# Altium schematic sheet Main.SchDoc
size A3; SheetNumber: 1; SheetTotal: 1
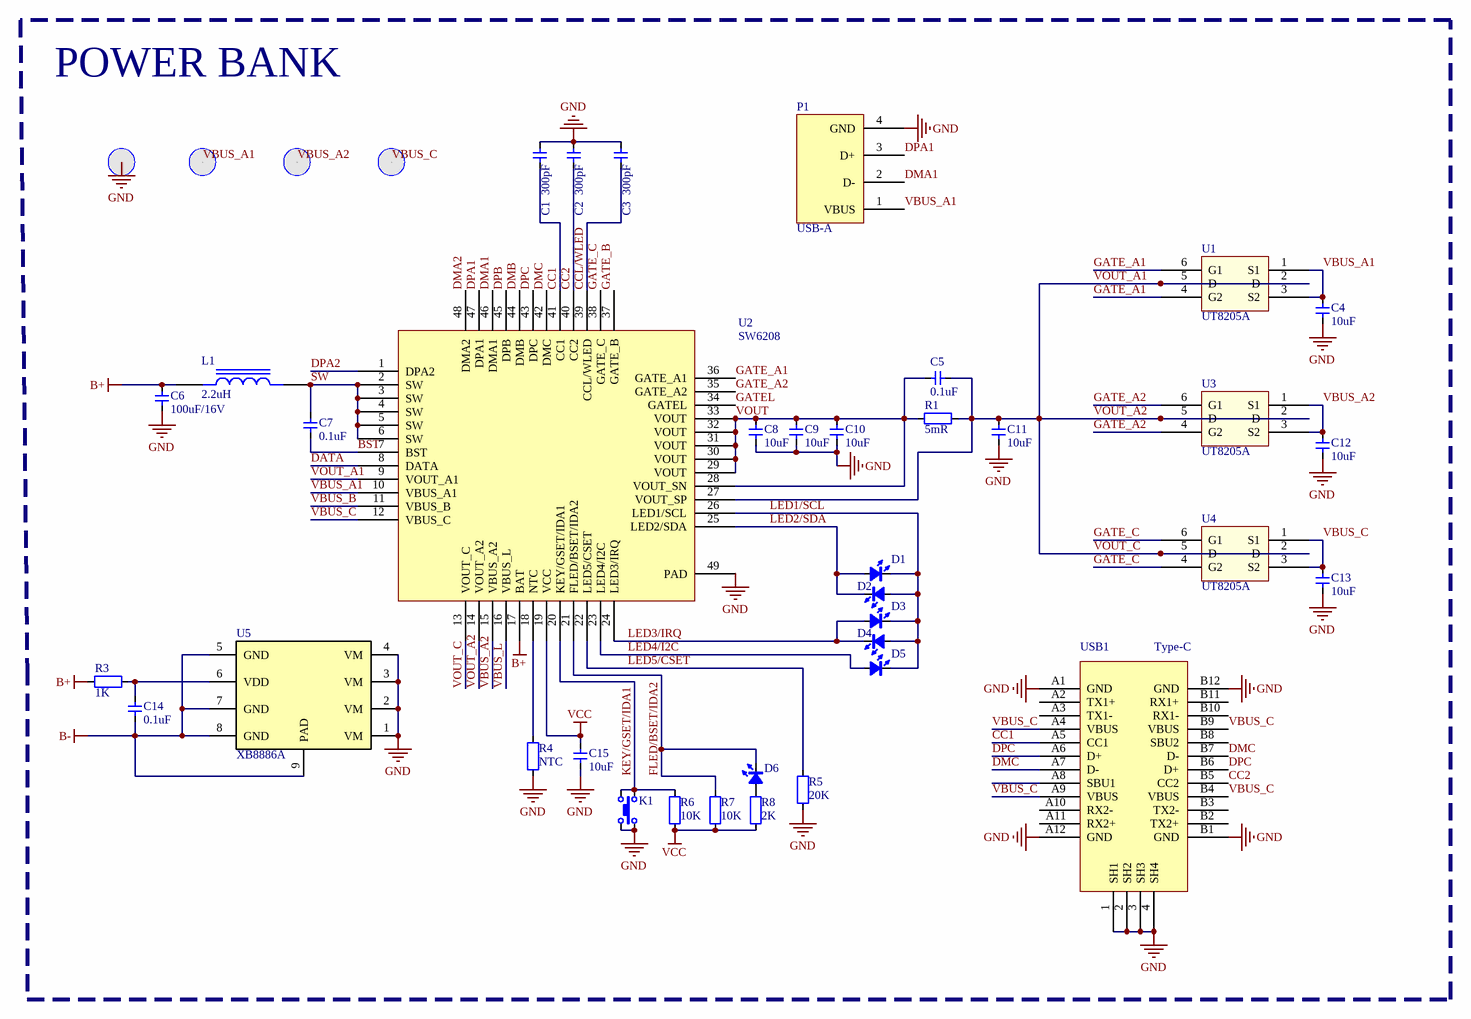
[diagram p0: Main.SchDoc]

## Parts
C1  300pF  [CAP_0402]
C2  300pF  [CAP_0402]
C3  300pF  [CAP_0402]
C4  10uF  [0603-CAP]
C5  0.1uF  [CAP_0402]
C6  100uF/16V  [1206-CAP]
C7  0.1uF  [CAP_0402]
C8  10uF  [0603-CAP]
C9  10uF  [0603-CAP]
C10  10uF  [0603-CAP]
C11  10uF  [0603-CAP]
C12  10uF  [0603-CAP]
C13  10uF  [0603-CAP]
C14  0.1uF  [CAP_0402]
C15  10uF  [CAP_0402]
D1  color?  [LED_0402_BLUE]  (value not drawn)
D2  color?  [LED_0402_BLUE]  (value not drawn)
D3  color?  [LED_0402_BLUE]  (value not drawn)
D4  color?  [LED_0402_BLUE]  (value not drawn)
D5  color?  [LED_0402_BLUE]  (value not drawn)
D6  color?  [LED_0402_GREEN]  (value not drawn)
K1  TACT 4P  [ButtonTACT_3.5*3.55_90]  (value not drawn)
L1  2.2uH  [IND_1040]
P1  USB-A  [USB-Short]
R1  5mR  [1206-RES]
R3  1K  [RES_0402]
R4  NTC  [0805-L]
R5  20K  [RES_0402]
R6  10K  [RES_0402]
R7  10K  [RES_0402]
R8  2K  [RES_0402]
T1  测试点  [TEST_PT]  (value not drawn)
T2  测试点  [TEST_PT]  (value not drawn)
T3  测试点  [TEST_PT]  (value not drawn)
T4  测试点  [TEST_PT]  (value not drawn)
U1  UT8205A  [SOT23-6]
U2  SW6208  [QFN-48_6x6]
U3  UT8205A  [SOT23-6]
U4  UT8205A  [SOT23-6]
U5  XB8886A  [SO-8-PAD]
USB1  Type-C  [Type-C-TOP]

## Blocks framed on the sheet
POWER BANK: C1-C15 D1-D6 K1 L1 P1 R1 R3-R8 T1-T4 U1-U5 USB1

## Nets
B+: C6.2 L1.1 R3.2 U2.17(BAT)
B-: C14.2 U5.5(GND) U5.7(GND) U5.8(GND) U5.9(PAD)
GND: C1.1 C2.1 C3.1 C4.1 C6.1 C8.1 C9.1 C10.1 C11.1 C12.1 C13.1 C15.2 K1.1 K1.3 P1.4(GND) R4.1 R5.1 T1.0 U2.49(PAD) U5.1(VM) U5.2(VM) U5.3(VM) U5.4(VM) USB1.1(SH1) USB1.2(SH2) USB1.3(SH3) USB1.4(SH4) USB1.A1(GND) USB1.A12(GND) USB1.B1(GND) USB1.B12(GND)
VCC: C15.1 R6.1 R7.1 R8.1 U2.19(VCC)
BST: C7.2 U2.7(BST)
CC1: C1.2 U2.41(CC1) USB1.A5(CC1)
CC2: C2.2 U2.40(CC2) USB1.B5(CC2)
CCL/WLED: C3.2 U2.39(CCL/WLED)
DATA: U2.8(DATA)
DMA1: P1.2(D-) U2.46(DMA1)
DMA2: U2.48(DMA2)
DMB: U2.44(DMB)
DMC: U2.42(DMC) USB1.A7(D-) USB1.B7(D-)
DPA1: P1.3(D+) U2.47(DPA1)
DPA2: U2.1(DPA2)
DPB: U2.45(DPB)
DPC: U2.43(DPC) USB1.A6(D+) USB1.B6(D+)
FLED/BSET/IDA2: D6.2(K) R7.2 U2.21(FLED/BSET/IDA2)
GATE_A1: U1.4(G2) U1.6(G1) U2.36(GATE_A1)
GATE_A2: U2.35(GATE_A2) U3.4(G2) U3.6(G1)
GATE_B: U2.37(GATE_B)
GATE_C: U2.38(GATE_C) U4.4(G2) U4.6(G1)
GATEL: U2.34(GATEL)
KEY/GSET/IDA1: K1.2 K1.4 R6.2 U2.20(KEY/GSET/IDA1)
LED1/SCL: D1.2(K) D2.1(A) D3.2(K) D4.1(A) D5.2(K) U2.26(LED1/SCL)
LED2/SDA: D1.1(A) D2.2(K) U2.25(LED2/SDA)
LED3/IRQ: D3.1(A) D4.2(K) U2.24(LED3/IRQ)
LED4/I2C: D5.1(A) U2.23(LED4/I2C)
LED5/CSET: R5.2 U2.22(LED5/CSET)
SW: C7.1 L1.2 U2.2(SW) U2.3(SW) U2.4(SW) U2.5(SW) U2.6(SW)
VBUS_A1: C4.2 P1.1(VBUS) T2.0 U1.1(S1) U1.3(S2) U2.10(VBUS_A1)
VBUS_A2: C12.2 T3.0 U2.15(VBUS_A2) U3.1(S1) U3.3(S2)
VBUS_B: U2.11(VBUS_B)
VBUS_C: C13.2 T4.0 U2.12(VBUS_C) U4.1(S1) U4.3(S2) USB1.A4(VBUS) USB1.A9(VBUS) USB1.B4(VBUS) USB1.B9(VBUS)
VBUS_L: U2.16(VBUS_L)
VOUT: C5.1 C8.2 C9.2 C10.2 R1.1 U2.28(VOUT_SN) U2.29(VOUT) U2.30(VOUT) U2.31(VOUT) U2.32(VOUT) U2.33(VOUT)
VOUT_A1: C5.2 C11.2 R1.2 U1.2(D) U1.5(D) U2.9(VOUT_A1) U2.13(VOUT_C) U2.14(VOUT_A2) U2.27(VOUT_SP) U3.2(D) U3.5(D) U4.2(D) U4.5(D)  [also labelled VOUT_A2, VOUT_C]
NetC14_1: C14.1 R3.1 U5.6(VDD)
NetD6_1: D6.1(A) R8.2
NetR4_2: R4.2 U2.18(NTC)

Not connected (* = marked no-connect by the designer): USB1 A2(TX1+) A3(TX1-) A8(SBU1) A10(RX2-) A11(RX2+) B2(TX2+) B3(TX2-) B8(SBU2) B10(RX1-) B11(RX1+)

## Library data of the parts
C1-C3 C5 C7 C14 C15 = 电容-0402: Capacitor; Value: 0.1u
C4 C8-C13 = 电容-0603: Capacitor; Value: 0.1u
C6 = 电容-1206: Capacitor; Value: 0.1u
D1-D6 = LED_0402: LED; Type: 0402; Value: color?
K1 = ButtonTACT: Button; value: 3.4x3.5; type: TACT 4P
L1 = 电感-1040: Fixed Inductors 4.7uH 30% SMD 1240; MF: Bourns; MP: SRR1240-4R7Y; Price: None; SnapEDA_Link: https://www.snapeda.com/parts/SRR1240-4R7Y/Bourns/view-part/1646614/?ref=snap; Check_prices: https://www.snapeda.com/parts/SRR1240-4R7Y/Bourns/view-part/1646614/?ref=eda; Availability: Bad; Package: None; Value: *
R1 = 电阻-1206: Resistor; Value: 22R
R3 R5-R8 = 电阻-0402: Resistor; Value: 22R
R4 = 电阻-0805: Resistor; Value: 22R
U2 = SW6208: 充电宝芯片
U5 = XB8886A: MF: Texas Instruments; MP: NE5532D; Value: *; Package: SOIC-8 Texas Instruments; Price: None; Availability: Unavailable; SnapEDA_Link: https://www.snapeda.com/parts/NE5532D/Texas%20Instruments/view-part/4299479/?ref=snap
USB1 = USB-Type-C-TOP